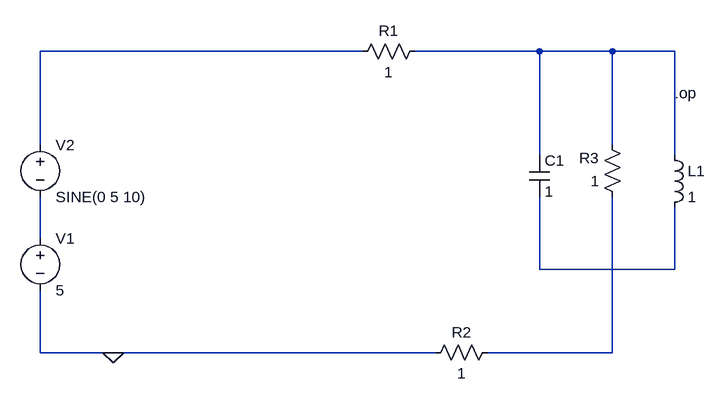
[diagram p0: schematic OP_V-Sine_V_DC_R+(R__C__L)+R.asc]
OP_V-Sine_V_DC_R+(R__C__L)+R.asc, the LTspice schematic file:
Version 4
SHEET 1 900 680
WIRE 368 64 -128 64
WIRE 640 64 448 64
WIRE 752 64 640 64
WIRE 848 64 752 64
WIRE -128 208 -128 64
WIRE 752 208 752 64
WIRE 640 224 640 64
WIRE 848 224 848 64
WIRE -128 352 -128 288
WIRE 640 400 640 288
WIRE 848 400 848 304
WIRE 848 400 640 400
WIRE -128 528 -128 432
WIRE -16 528 -128 528
WIRE 480 528 -16 528
WIRE 752 528 752 288
WIRE 752 528 560 528
FLAG -16 528 0
SYMBOL voltage -128 336 R0
SYMATTR InstName V1
SYMATTR Value 5
SYMBOL voltage -128 192 R0
SYMATTR InstName V2
SYMATTR Value SINE(0 5 10)
SYMBOL res 464 48 R90
WINDOW 0 0 56 VBottom 2
WINDOW 3 32 56 VTop 2
SYMATTR InstName R1
SYMATTR Value 1
SYMBOL res 576 512 R90
WINDOW 0 0 56 VBottom 2
WINDOW 3 32 56 VTop 2
SYMATTR InstName R2
SYMATTR Value 1
SYMBOL res 768 304 R180
WINDOW 0 36 76 Left 2
WINDOW 3 36 40 Left 2
SYMATTR InstName R3
SYMATTR Value 1
SYMBOL cap 624 224 R0
SYMATTR InstName C1
SYMATTR Value 1
SYMBOL ind 832 208 R0
SYMATTR InstName L1
SYMATTR Value 1
TEXT 848 128 Left 2 !.op

The netlist it stands for:
* OP_V-Sine_V_DC_R+(R__C__L)+R.asc
V1 N003 0 5
V2 N001 N003 SINE(0 5 10)
R1 N002 N001 1
R2 N005 0 1
R3 N005 N002 1
C1 N002 N004 1
L1 N002 N004 1
.op
.backanno
.end